# Altium project 1010810PA_HVFlyback_GDTestboard.PrjPcb (part 2 of 2)

## Sheet 1010829PA_HVFlyback_GD_Testboard_GateDrive.SchDoc: Schematitel
size A3; CompanyName: drivetek ag; DrawnBy: NLE; Address1: industriestrasse 37; Address2: 2555 brügg; Address3: Switzerland; SheetNumber: 10; SheetTotal: 10; ProjectTitle: HVFlyback_GDTestboard; PageSetup: Record=PageOptions|CenterHorizontal=True|CenterVertical=True|PrintScale=1.00|XCorrection=1.00|YCorrection=1.00|PrintKind=1|BorderSize=5000000|LeftOffset=0|BottomOffset=0|Orientation=2|PaperLength=1000|PaperWidth=1000|Scale=100|PaperSource=7|PrintQuality=-4|MediaType=1|DitherType=10|PaperKind=A3|PrintScaleMode=1
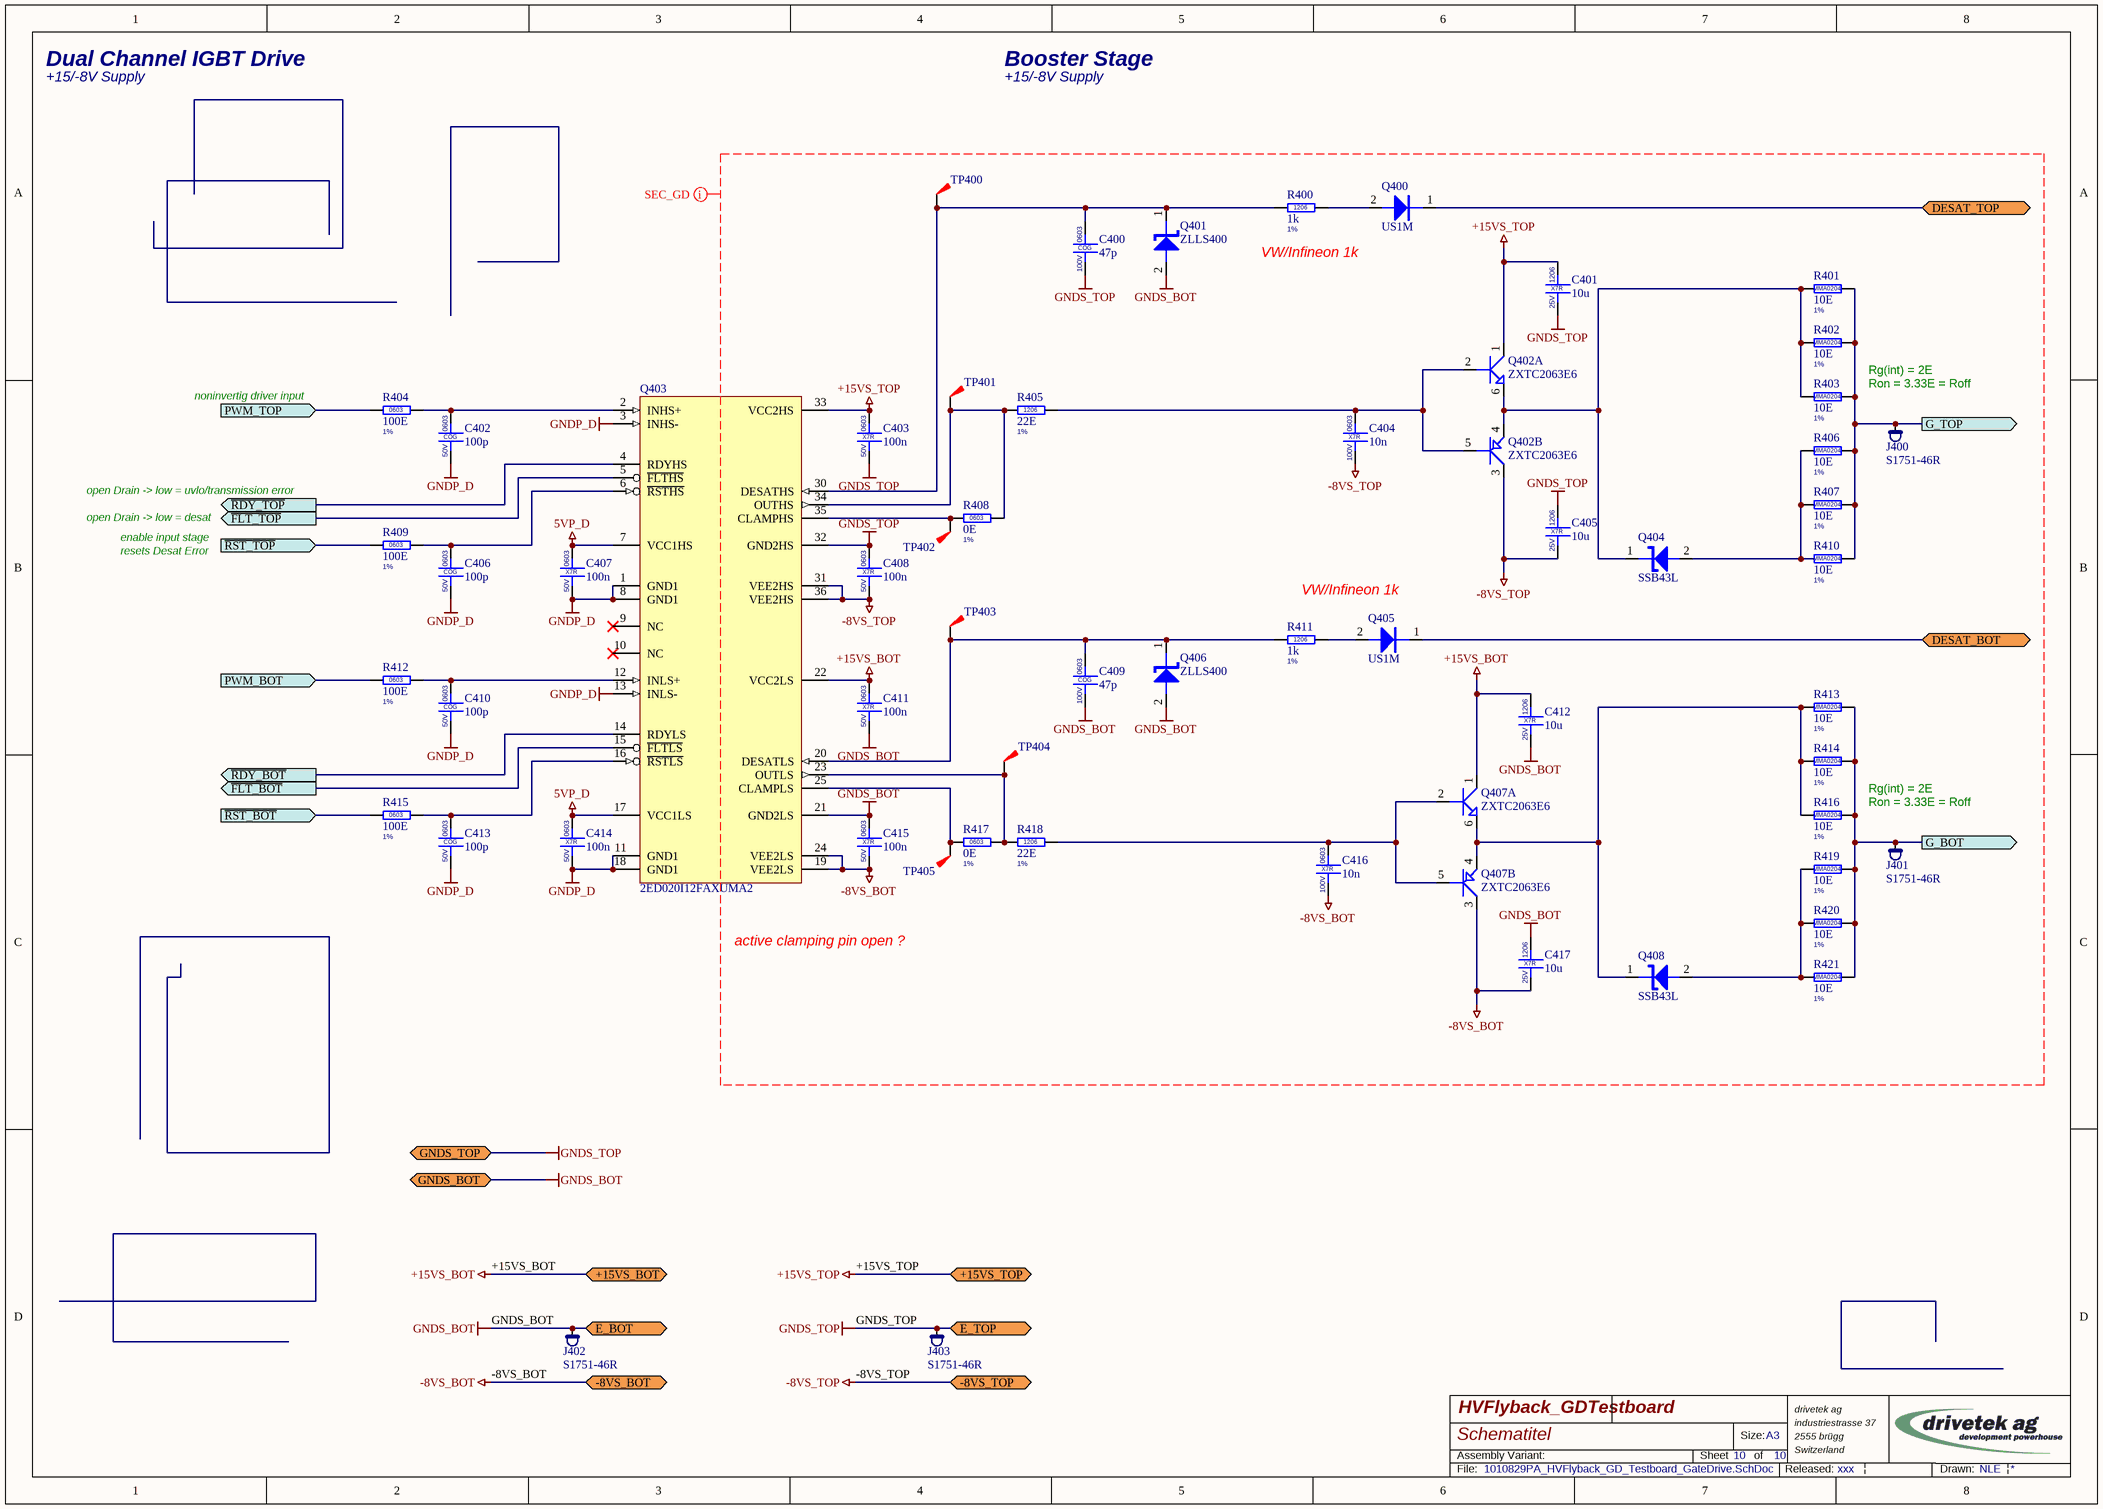
[diagram p3: 1010829PA_HVFlyback_GD_Testboard_GateDrive.SchDoc]

### Parts
C400  47p  CaseName: 0603  Type3: COG  Voltage: 100V  [02_0603_DRK_1-7x1-0x0-9]
C401  10u  Type3: X7R  Voltage: 25V  CaseName: 1206  [02_1206_DRK_3-4x1-8x1-8]
C402  100p  CaseName: 0603  Type3: COG  Voltage: 50V  [02_0603_DRK_1-7x1-0x0-9]
C403  100n  CaseName: 0603  Type3: X7R  Voltage: 50V  [02_0603_DRK_1-7x1-0x0-9]
C404  10n  CaseName: 0603  Type3: X7R  Voltage: 100V  [02_0603_DRK_1-7x1-0x0-9]
C405  10u  Type3: X7R  Voltage: 25V  CaseName: 1206  [02_1206_DRK_3-4x1-8x1-8]
C406  100p  CaseName: 0603  Type3: COG  Voltage: 50V  [02_0603_DRK_1-7x1-0x0-9]
C407  100n  CaseName: 0603  Type3: X7R  Voltage: 50V  [02_0603_DRK_1-7x1-0x0-9]
C408  100n  CaseName: 0603  Type3: X7R  Voltage: 50V  [02_0603_DRK_1-7x1-0x0-9]
C409  47p  CaseName: 0603  Type3: COG  Voltage: 100V  [02_0603_DRK_1-7x1-0x0-9]
C410  100p  CaseName: 0603  Type3: COG  Voltage: 50V  [02_0603_DRK_1-7x1-0x0-9]
C411  100n  CaseName: 0603  Type3: X7R  Voltage: 50V  [02_0603_DRK_1-7x1-0x0-9]
C412  10u  Type3: X7R  Voltage: 25V  CaseName: 1206  [02_1206_DRK_3-4x1-8x1-8]
C413  100p  CaseName: 0603  Type3: COG  Voltage: 50V  [02_0603_DRK_1-7x1-0x0-9]
C414  100n  CaseName: 0603  Type3: X7R  Voltage: 50V  [02_0603_DRK_1-7x1-0x0-9]
C415  100n  CaseName: 0603  Type3: X7R  Voltage: 50V  [02_0603_DRK_1-7x1-0x0-9]
C416  10n  CaseName: 0603  Type3: X7R  Voltage: 100V  [02_0603_DRK_1-7x1-0x0-9]
C417  10u  Type3: X7R  Voltage: 25V  CaseName: 1206  [02_1206_DRK_3-4x1-8x1-8]
J400  S1751-46R  [13_PAD_DRK_HARWIN_S1751-46]
J401  S1751-46R  [13_PAD_DRK_HARWIN_S1751-46]
J402  S1751-46R  [13_PAD_DRK_HARWIN_S1751-46]
J403  S1751-46R  [13_PAD_DRK_HARWIN_S1751-46]
Q400  US1M  [03_SMA_DRK]
Q401  ZLLS400  [03_SOD323_DRK]
Q402  ZXTC2063E6  [03_SOT23-6_DRK]  (parts A,B of 2)
Q403  2ED020I12FAXUMA2  [04_DSO-36_DRK]
Q404  SSB43L  [03_SMB_DRK]
Q405  US1M  [03_SMA_DRK]
Q406  ZLLS400  [03_SOD323_DRK]
Q407  ZXTC2063E6  [03_SOT23-6_DRK]  (parts A,B of 2)
Q408  SSB43L  [03_SMB_DRK]
R400  1k  Tolerance: 1%  CaseName: 1206  [01_1206_DRK_3-4x1-8x0-65]
R401  10E  Tolerance: 1%  CaseName: MMA0204  [01_MMA0204_DRK]
R402  10E  Tolerance: 1%  CaseName: MMA0204  [01_MMA0204_DRK]
R403  10E  Tolerance: 1%  CaseName: MMA0204  [01_MMA0204_DRK]
R404  100E  Tolerance: 1%  CaseName: 0603  [01_0603_DRK_1-7x1-0x0-55]
R405  22E  Tolerance: 1%  CaseName: 1206  [01_1206_DRK_3-4x1-8x0-65]
R406  10E  Tolerance: 1%  CaseName: MMA0204  [01_MMA0204_DRK]
R407  10E  Tolerance: 1%  CaseName: MMA0204  [01_MMA0204_DRK]
R408  0E  Tolerance: 1%  CaseName: 0603  [01_0603_DRK_1-7x1-0x0-55]
R409  100E  Tolerance: 1%  CaseName: 0603  [01_0603_DRK_1-7x1-0x0-55]
R410  10E  Tolerance: 1%  CaseName: MMA0204  [01_MMA0204_DRK]
R411  1k  Tolerance: 1%  CaseName: 1206  [01_1206_DRK_3-4x1-8x0-65]
R412  100E  Tolerance: 1%  CaseName: 0603  [01_0603_DRK_1-7x1-0x0-55]
R413  10E  Tolerance: 1%  CaseName: MMA0204  [01_MMA0204_DRK]
R414  10E  Tolerance: 1%  CaseName: MMA0204  [01_MMA0204_DRK]
R415  100E  Tolerance: 1%  CaseName: 0603  [01_0603_DRK_1-7x1-0x0-55]
R416  10E  Tolerance: 1%  CaseName: MMA0204  [01_MMA0204_DRK]
R417  0E  Tolerance: 1%  CaseName: 0603  [01_0603_DRK_1-7x1-0x0-55]
R418  22E  Tolerance: 1%  CaseName: 1206  [01_1206_DRK_3-4x1-8x0-65]
R419  10E  Tolerance: 1%  CaseName: MMA0204  [01_MMA0204_DRK]
R420  10E  Tolerance: 1%  CaseName: MMA0204  [01_MMA0204_DRK]
R421  10E  Tolerance: 1%  CaseName: MMA0204  [01_MMA0204_DRK]
TP400  TP THT Dia 0.8mm, Hole 0.3mm  [13_TP_0-3_0-8mm]  (value not drawn)  (no BOM)
TP401  TP THT Dia 0.8mm, Hole 0.3mm  [13_TP_0-3_0-8mm]  (value not drawn)  (no BOM)
TP402  TP THT Dia 0.8mm, Hole 0.3mm  [13_TP_0-3_0-8mm]  (value not drawn)  (no BOM)
TP403  TP THT Dia 0.8mm, Hole 0.3mm  [13_TP_0-3_0-8mm]  (value not drawn)  (no BOM)
TP404  TP THT Dia 0.8mm, Hole 0.3mm  [13_TP_0-3_0-8mm]  (value not drawn)  (no BOM)
TP405  TP THT Dia 0.8mm, Hole 0.3mm  [13_TP_0-3_0-8mm]  (value not drawn)  (no BOM)

### Ports
+15VS_BOT (bidir), +15VS_TOP (bidir), -8VS_BOT (bidir), -8VS_TOP (bidir), DESAT_BOT (bidir), DESAT_TOP (bidir), E_BOT (bidir), E_TOP (bidir), G_BOT (out), G_TOP (out), GNDS_BOT (bidir), GNDS_TOP (bidir), PWM_BOT (in), PWM_TOP (in), ~{FLT_BOT} (out), ~{FLT_TOP} (out), ~{RDY_BOT} (out), ~{RDY_TOP} (out), ~{RST_BOT} (in), ~{RST_TOP} (in)

### Nets
5VP_D: C407.1 C414.1 Q403.7(VCC1HS) Q403.17(VCC1LS)
+15VS_BOT: C401.1 C403.1 C411.1 C412.1 Q402.1 Q403.22(VCC2LS) Q403.33(VCC2HS) Q407.1 ; port +15VS_BOT, port +15VS_TOP  [also labelled +15VS_TOP]
-8VS_BOT: C404.2 C405.2 C408.2 C415.2 C416.2 C417.2 Q402.3 Q403.19(VEE2LS) Q403.24(VEE2LS) Q403.31(VEE2HS) Q403.36(VEE2HS) Q407.3 ; port -8VS_BOT, port -8VS_TOP  [also labelled -8VS_TOP]
DC+: Q400.1 ; port DESAT_TOP
GNDP_D: C402.2 C406.2 C407.2 C410.2 C413.2 C414.2 Q403.1(GND1) Q403.3(INHS-) Q403.8(GND1) Q403.11(GND1) Q403.13(INLS-) Q403.18(GND1)
GNDS_BOT: C400.2 C401.2 C403.2 C405.1 C408.1 C409.2 C411.2 C412.2 C415.1 C417.1 J402.1 J403.1 Q401.2 Q403.21(GND2LS) Q403.32(GND2HS) Q406.2 ; port E_BOT, port E_TOP, port GNDS_TOP, port GNDS_BOT  [also labelled GNDS_TOP]
NetC100_1: R409.1 ; port ~{RST_TOP}
NetC101_1: R415.1 ; port ~{RST_BOT}
NetC400_1: C400.1 Q401.1 Q403.30(DESATHS) R400.1 TP400.1
NetC402_1: C402.1 Q403.2(INHS+) R404.2
NetC404_1: C404.1 Q402.2 Q402.5 R405.1
NetC406_1: C406.1 Q403.6(~{RSTHS}) R409.2
NetC409_1: C409.1 Q403.20(DESATLS) Q406.1 R411.1 TP403.1
NetC410_1: C410.1 Q403.12(INLS+) R412.2
NetC413_1: C413.1 Q403.16(~{RSTLS}) R415.2
NetC416_1: C416.1 Q407.2 Q407.5 R418.1
NetJ110_1: R404.1 ; port PWM_TOP
NetJ112_1: Q403.4(RDYHS) ; port ~{RDY_TOP}
NetJ114_1: R412.1 ; port PWM_BOT
NetJ116_1: Q403.5(~{FLTHS}) ; port ~{FLT_TOP}
NetJ121_1: Q403.14(RDYLS) ; port ~{RDY_BOT}
NetJ124_1: Q403.15(~{FLTLS}) ; port ~{FLT_BOT}
NetJ400_1: J400.1 R401.1 R402.1 R403.1 R406.1 R407.1 R410.1 ; port G_TOP
NetJ401_1: J401.1 R413.1 R414.1 R416.1 R419.1 R420.1 R421.1 ; port G_BOT
NetQ400_2: Q400.2 R400.2
NetQ402_4: Q402.4 Q402.6 Q404.1 R401.2 R402.2 R403.2
NetQ403_23: Q403.23(OUTLS) R417.1 R418.2 TP404.1
NetQ403_25: Q403.25(CLAMPLS) R417.2 TP405.1
NetQ403_34: Q403.34(OUTHS) R405.2 R408.2 TP401.1
NetQ403_35: Q403.35(CLAMPHS) R408.1 TP402.1
NetQ404_2: Q404.2 R406.2 R407.2 R410.2
NetQ405_1: Q405.1 ; port DESAT_BOT
NetQ405_2: Q405.2 R411.2
NetQ407_4: Q407.4 Q407.6 Q408.1 R413.2 R414.2 R416.2
NetQ408_2: Q408.2 R419.2 R420.2 R421.2

Not connected (* = marked no-connect by the designer): Q403 9(NC)* 10(NC)*

### Layout directives
net class SEC_GD: +15VS_BOT, +15VS_TOP, -8VS_BOT, -8VS_TOP, GNDS_BOT, GNDS_TOP

### Notes on the sheet
- Dual Channel IGBT Drive
- +15/-8V Supply
- Booster Stage
- VW/Infineon 1k
- Ron = 3.33E = Roff
- Rg(int) = 2E
- noninvertig driver input
- open Drain -> low = uvlo/transmission error
- open Drain -> low = desat
- resets Desat Error
- enable input stage
- active clamping pin open ?
- Assembly Variant:
- Sheet
- Size:
- of
- A3
- File:
- Released:
- |
- Drawn:

### Library data of the parts
C400 C409 = 02-0270: Part Description: Ceramic 0603 47pF 100V COG Flexiterm; Manufacturer 1: Kemet; Manufacturer Part Number 1: C0603X470J1GACTU; LatestRevision Note: Initial; Type1: CAP; Type2: Ceramic; Tolerance: 5; Order Number: 80-C0603X470J1G; Part Number: 02-0270; Author: RLE; PartValue: 47p; ROHS: True; ComponentLink1Description: Datasheet; ComponentLink1URL: http://www.kemet.com/kemet/web/homepage/kechome.nsf/file/Flexible%20Termination%20Ceramic%20Chip%20Capacitors%20%28FT-CAP%29/$file/KEM_C1013_X7R_FT-CAP_SMD.pdf; LatestRevision Date: 22.06.2012; Distributor: Mouser; Price: 0.36
C401 C405 C412 C417 = 02-0262: Part Description: Ceramic 1206 10uF 25V X7R flexiterm, automotive; Manufacturer 1: TDK; Manufacturer Part Number 1: CGA5L1X7R1E106M160AE; Type1: CAP; Type2: Ceramic; Tolerance: 20; Order Number: 445-7969-1-ND; LatestRevision Note: Initial; Order Number 2: 810-CGA5L1X7R1E106KS; Part Number: 02-0262; Author: CBA; PartValue: 10u; ROHS: True; ComponentLink1Description: Datasheet; ComponentLink1URL: http://tdk.com/pdf/automotive_B11.pdf; Distributor: Digikey; Price: 1.24; LatestRevision Date: 15.06.2012; Distributor 2: Mouser; Manufacturer 2: TDK; Manufacturer Part Number 2: CGA5L1X7R1E106K160AE
C402 C406 C410 C413 = 02-0380: Part Description: Ceramic 0603 100pF 50V 5% C0G  AEC-Q200; Manufacturer 1: Murata; Manufacturer Part Number 1: GCM1885C1H101JA16D; LatestRevision Note: Initial; Type1: CAP; Type2: Ceramic; Tolerance: 5; Order Number: 81-GCM1885C1H101JA6D; Part Number: 02-0380; Author: RLE; PartValue: 100p; ROHS: True; ComponentLink1Description: Datasheet; ComponentLink1URL: http://www.murata.com/products/catalog/pdf/c03e.pdf; LatestRevision Date: 12.09.2016; Distributor: Mouser; Price: 0.1
C403 C407 C408 C411 C414 C415 = 02-0342: Part Description: Ceramic 0603 100nF 50V X7R, AEC-Q200, Fail-Save, Deflecting Crack; Manufacturer 1: Murata; Manufacturer Part Number 1: GCJ188R71H104KA12D; LatestRevision Note: Initial; Type1: CAP; Type2: Ceramic; Tolerance: 10; Order Number: 81-GCJ188R71H104KA2D; Part Number: 02-0342; Author: RLE; PartValue: 100n; ROHS: True; ComponentLink1Description: Datasheet; ComponentLink1URL: http://www.murata.com/~/media/webrenewal/support/library/catalog/products/capacitor/mlcc/c03e.ashx; LatestRevision Date: 15.07.2015; Distributor: Mouser; Price: 0.257
C404 C416 = 02-0313: Part Description: Ceramic 0603 10n 100V 10% X7R, AEC-Q200; Manufacturer 1: Murata; Manufacturer Part Number 1: GCM188R72A103KA37D; LatestRevision Note: Initial; Type1: CAP; Type2: Ceramic; Tolerance: 10; Order Number: 81-GCM188R72A103KA7D; Part Number: 02-0313; Author: RLE; PartValue: 10n; ROHS: True; ComponentLink1Description: Datasheet; ComponentLink1URL: http://psearch.murata.com/capacitor/product/GCM1885C1H100JA16%23.pdf; LatestRevision Date: 25.06.2014; Distributor: Mouser; Price: 0.1
J400-J403 = 13-0487: Probe Hook; Part Description: SMD Probe Hook 2mm HIGH, 3.45x1.85mm; Manufacturer 1: Harwin; LatestRevision Note: Initial; Type1: TP; Type2: SMD; Order Number: 952-1478-2-ND; Order Number 2: 855-S1751-46R; Part Number: 13-0487; Author: CSI; PartValue: S1751-46R; ROHS: True; ComponentLink1Description: Datasheet; ComponentLink1URL: https://cdn.harwin.com/pdfs/60page187.pdf; LatestRevision Date: 19.09.2016; Manufacturer Part Number 1: S1751-46R; Distributor: DigiKey; Price: 0.25; Distributor 2: Mouser
Q400 Q405 = 03-0182: Part Description: Ultra Fast Recovery Rectifier, 1000V / 1A / 75ns; Manufacturer 1: Vishay; Manufacturer Part Number 1: US1MHE3_A/H; LatestRevision Note: Initial; Type1: DIODE; Type2: Power; Voltage: 1000V; Current: 1A; Order Number: 78-US1MHE3_A/H; Order Number 2: 78-US1MHE3_A/I; Part Number: 03-0182; Author: RLE; PartValue: US1M; CaseName: SMA; ROHS: True; ComponentLink1Description: Datasheet; ComponentLink1URL: http://www.vishay.com/docs/88768/88768.pdf; LatestRevision Date: 29.12.2011; Distributor: Mouser; Price: 0.225; Distributor 2: Mouser
Q401 Q406 = 03-0389: Part Description: Low VF, fast switching Schottky, extremely low leakage; Manufacturer 1: Diodes; Manufacturer Part Number 1: ZLLS400TA; LatestRevision Note: Checked; Type1: DIODE; Type2: Signal; Voltage: 40V; Current: 520m; Order Number: 522-ZLLS400TA; Checked: CRA; Part Number: 03-0389; Author: RLE; PartValue: ZLLS400; CaseName: SOD323; ROHS: True; ComponentLink1Description: Datasheet; ComponentLink1URL: http://www.diodes.com/_files/datasheets/ZLLS400.pdf; LatestRevision Date: 24.03.2016; Distributor: Mouser; Price: 0.413
Q402 Q407 = 03-0248: Part Description: 40V /3.5A  Complementary (NPN/PNP) Medium Power Transistor, AEC-Q 101; Manufacturer 1: Diodes Inc; LatestRevision Note: Initial; Type2: Power; Voltage: 40V; Current: 3A5; Order Number: 522-ZXTC2063E6TA; Order Number 2: ZXTC2063E6CT-ND; Part Number: 03-0248; Author: RLE; PartValue: ZXTC2063E6; CaseName: SOT23-6; ROHS: True; ComponentLink1Description: Datasheet; ComponentLink1URL: http://www.diodes.com/datasheets/ZXTC2063E6.pdf; LatestRevision Date: 13.12.2013; Manufacturer Part Number 1: ZXTC2063E6; Distributor: Mouser; Price: 0.745; Distributor 2: DigiKey
Q403 = 04-0486: Dual IGBT Driver IC; Manufacturer: Infineon Technologies; Part Description: Galvanic isolated dual channel IGBT driver - 2A; Manufacturer 1: Infineon; LatestRevision Note: Initial; Type1: MIXSIG; Order Number: 2762284; Order Number 2: 726-2ED020I12FAXUMA2; ManufacturerPartNumber: 2ED020I12FA; PackageReference: PG-DSO-36; Part Number: 04-0486; Author: RVI; PartValue: 2ED020I12FAXUMA2; CaseName: DSO-36; ROHS: True; ComponentLink1Description: Datasheet; ComponentLink1URL: https://www.infineon.com/dgdl/Infineon-2ED020I12FA-DS-v03_01-EN.pdf?fileId=db3a30432e779412012e7b87d2b23878; LatestRevision Date: 21.07.2017; Manufacturer Part Number 1: 2ED020I12FAXUMA2; Distributor: Farnell; Price: 9.96; Distributor 2: Mouser
Q404 Q408 = 03-0112: Part Description: High current density schottky rectifier; Manufacturer 1: Vishay; LatestRevision Note: Checked; Type1: DIODE; Type2: Power; Voltage: 30V; Current: 4A; Order Number: SSB43L-E3/52TGICT-ND; Checked: HHU; Part Number: 03-0112; Author: MSC; PartValue: SSB43L; CaseName: SMB; ROHS: True; ComponentLink1Description: Datasheet; ComponentLink1URL: http://www.vishay.com/docs/88884/ssb43l.pdf; LatestRevision Date: 27.11.2008; Manufacturer Part Number 1: SSB43L; Distributor: Digikey; Price: 0.45
R400 R411 = 01-0257: Part Description: 1206 1k 200V 0.125W 1%; Manufacturer 1: Multicomp; Manufacturer Part Number 1: MC 0.125W1206 1% 1K; LatestRevision Note: Checked; Type1: RES; Type2: Thickfilm; Voltage: 200V; Power: 125m; Checked: CBA; Order Number: 9335757; Part Number: 01-0257; Author: CBA; PartValue: 1k; ROHS: True; ComponentLink1Description: Datasheet; ComponentLink1URL: http://www.farnell.com/datasheets/90824.pdf; LatestRevision Date: 06.10.2006; Distributor: Farnell; Price: 0.055
R401 R402 R406 R407 R410 R413 R414 R419-R421 = 01-0574: Part Description: Mini-Melf 10R 200V 0.25W; Manufacturer 1: Vishay; Manufacturer Part Number 1: MMA02040C1009F; LatestRevision Note: Initial; Type1: RES; Type2: Metalfilm; Voltage: 200V; Power: 250m; Order Number: 594-MMA02040C1009FB3; Order Number 2: 3087542; Part Number: 01-0574; Author: MFR; PartValue: 10E; ROHS: True; ComponentLink1Description: Datasheet; ComponentLink1URL: http://www.vishay.com/docs/28713/melfprof.pdf; LatestRevision Date: 15.06.2012; Distributor: Mouser; Price: 0.1; Distributor 2: Farnell
R403 R416 = 01-0574: Part Description: Mini-Melf 10R 200V 0.25W; Manufacturer 1: Vishay; Manufacturer Part Number 1: MMA02040C1009F; LatestRevision Note: Initial; Type1: RES; Type2: Metalfilm; Power: 250m; Order Number: 594-MMA02040C1009FB3; Voltage: 200V; Order Number 2: 3087542; Part Number: 01-0574; Author: MFR; PartValue: 10E; ROHS: True; ComponentLink1Description: Datasheet; ComponentLink1URL: http://www.vishay.com/docs/28713/melfprof.pdf; LatestRevision Date: 15.06.2012; Distributor: Mouser; Price: 0.1; Distributor 2: Farnell
R404 R409 R412 R415 = 01-0770: Part Description: 0603 100E 75VV 0.1W 1% 100ppm, AEC-Q200; Manufacturer 1: Panasonic; Manufacturer Part Number 1: ERJ3EKF1000V; LatestRevision Note: Inital; Type1: RES; Type2: Thickfilm; Voltage: 75V; Power: 100m; Order Number: 2303059; Part Number: 01-0770; Author: RVI; PartValue: 100E; ROHS: True; ComponentLink1Description: Datasheet; ComponentLink1URL: http://www.farnell.com/datasheets/2111203.pdf?_ga=2.233800540.312604292.1501488576-657638312.1494329784; LatestRevision Date: 31.07.2017; Distributor: Farnell; Price: 0.05
R405 R418 = 01-0675: Part Description: 1206 22E 200V 500mW 1% AEC-Q200; Manufacturer 1: Vishay; Manufacturer Part Number 1: CRCW120622R0FKEAHP; LatestRevision Note: Initial; Type1: RES; Type2: Thickfilm; Voltage: 200V; Power: 500m; Order Number: 71-CRCW120622R0FKEAH; Order Number 2: 541-22.0UTR-ND; Part Number: 01-0675; Author: CSI; PartValue: 22E; ROHS: True; ComponentLink1Description: Datasheet; ComponentLink1URL: http://www.vishay.com/docs/20043/crcwhpe3.pdf; LatestRevision Date: 27.01.2015; Distributor: Mouser; Price: 0.098; Distributor 2: Digikey
R408 R417 = 01-0128: Part Description: 0603 0E 50V 0.063W 1%; Manufacturer 1: Multicomp; Manufacturer Part Number 1: MC 0.063W 0603 0R; LatestRevision Note: Checked; Type1: RES; Type2: Thickfilm; Voltage: 50V; Power: 63m; Checked: CBA; Order Number: 9331662; Part Number: 01-0128; Author: CBA; PartValue: 0E; ROHS: True; ComponentLink1Description: Datasheet; ComponentLink1URL: http://www.farnell.com/datasheets/90824.pdf; LatestRevision Date: 06.10.2006; Distributor: Farnell; Price: 0.06
TP400-TP405 = 13-0524: Part Description: Test point THT - Dia 0.8mm, Hole 0.3mm; LatestRevision Note: Initial; Type2: TH; Part Number: 13-0524; Author: RVI; Type1: TP; PartValue: TP THT Dia 0.8mm, Hole 0.3mm; CaseName: 0.8mm; ROHS: True; ComponentLink1Description: Datasheet; LatestRevision Date: 10.07.2017; Price: 0

## Sheet 1010829PA_HVFlyback_GD_Testboard_PowerStage.SchDoc: Flyback
size A4; CompanyName: drivetek ag; DrawnBy: NLE; Address1: industriestrasse 37; Address2: 2555 brügg; Address3: Switzerland; SheetNumber: 2; SheetTotal: 2; ProjectTitle: HVFlyback_GDTestboard
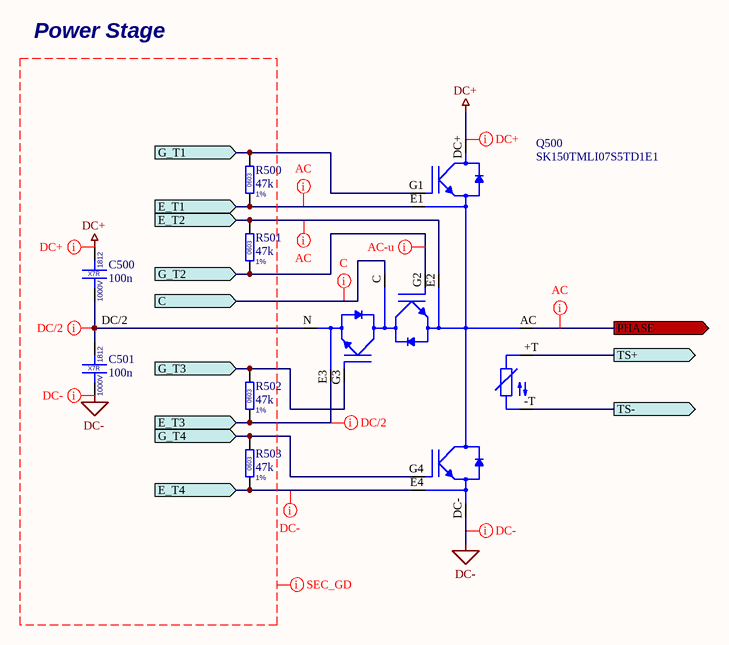
[diagram p4: 1010829PA_HVFlyback_GD_Testboard_PowerStage.SchDoc]

### Parts
C500  100n  Voltage: 1000V  CaseName: 1812  Type3: X7R  [02_1812_DRK_1-65mm]
C501  100n  Voltage: 1000V  CaseName: 1812  Type3: X7R  [02_1812_DRK_1-65mm]
Q500  SK150TMLI07S5TD1E1  [03_SK150TMLI07S5TD1E1]  (no BOM)
R500  47k  Tolerance: 1%  CaseName: 0603  [01_0603_DRK_1-7x1-0x0-55]
R501  47k  Tolerance: 1%  CaseName: 0603  [01_0603_DRK_1-7x1-0x0-55]
R502  47k  Tolerance: 1%  CaseName: 0603  [01_0603_DRK_1-7x1-0x0-55]
R503  47k  Tolerance: 1%  CaseName: 0603  [01_0603_DRK_1-7x1-0x0-55]

### Ports
C (in), E_T1 (in), E_T2 (in), E_T3 (in), E_T4 (in), G_T1 (in), G_T2 (in), G_T3 (in), G_T4 (in), PHASE (out), TS+ (out), TS- (out)

### Nets
DC+: C500.1 Q500.DC+
DC-: C501.2 Q500.DC-
GNDS_BOT: Q500.E1 Q500.E2 R500.2 R501.1 ; port E_T1, port E_T2
DC/2: C500.2 C501.1 Q500.N
NetJ113_1: Q500.AC ; port PHASE
NetJ117_1: Q500.+T ; port TS+
NetJ120_1: Q500.-T ; port TS-
NetJ400_1: Q500.G1 R500.1 ; port G_T1
NetJ401_1: Q500.G2 R501.2 ; port G_T2
NetQ405_1: Q500.C ; port C
NetQ500_E3: Q500.E3 R502.2 ; port E_T3
NetQ500_E4: Q500.E4 R503.2 ; port E_T4
NetQ500_G3: Q500.G3 R502.1 ; port G_T3
NetQ500_G4: Q500.G4 R503.1 ; port G_T4

### Layout directives
net class DC+: DC+
net class DC/2: DC/2, NetQ500_E3
net class DC-: DC-, NetQ500_E4
net class AC: GNDS_BOT, NetJ113_1
net class C: NetQ405_1
net class SEC_GD: DC+, DC-, DC/2
net class AC-u: NetJ401_1

### Notes on the sheet
- Power Stage
- Assembly Variant:
- Sheet
- Size:
- of
- A4
- File:
- Released:
- |
- Drawn:

### Library data of the parts
C500 C501 = 02-0279: Part Description: Ceramic 1812 100n 1000VDC X7R flexiterm; Manufacturer 1: Kemet; Manufacturer Part Number 1: C1812X104KDRACTU; LatestRevision Note: Initial; Type1: CAP; Type2: Ceramic; Tolerance: 10; Order Number: 80-C1812X104KDRACTU; Part Number: 02-0279; Author: RLE; PartValue: 100n; ROHS: True; ComponentLink1Description: Datasheet; ComponentLink1URL: http://www.kemet.com/kemet/web/homepage/kechome.nsf/file/KEM_C1034_X7R_HV_ARC_SMD/$file/KEM_C1034_X7R_HV_ARC_SMD.pdf; LatestRevision Date: 04.07.2012; Distributor: Mouser; Price: 0.92
Q500 = 03-0421: Part Description: Single phase TNPC, 650V, 150A, mit NTC, Preliminary; Manufacturer 1: Semikron; LatestRevision Note: Initial; Type1: MODULE; Type2: Power; Voltage: 650V; Current: 150A; Part Number: 03-0421; Author: NLE; PartValue: SK150TMLI07S5TD1E1; CaseName: SEMITOP E1; ROHS: False; ComponentLink1Description: Datasheet; LatestRevision Date: 13.11.2017; Manufacturer Part Number 1: SK150TMLI07S5TD1E1; Distributor: Semikron; Price: 0; ComponentLink1URL: K:\Volkswagen\1779_LE_BZ_Luftversorgung\03_Hardware\Datenblätter VW ELV\Modul\OFF-17-0180.01_VW_SEMITOPE1_technical information 24.08.17.pdf; Order Number: SK150TMLI07S5TD1E1
R500-R503 = 01-0088: Part Description: 0603 47k 50V 0.063W 1%; Manufacturer 1: Multicomp; Manufacturer Part Number 1: MC 0.063W 0603 1% 47K; LatestRevision Note: Checked; Type1: RES; Type2: Thickfilm; Voltage: 50V; Power: 63m; Checked: CBA; Order Number: 9331255; Part Number: 01-0088; Author: CBA; PartValue: 47k; ROHS: True; ComponentLink1Description: Datasheet; ComponentLink1URL: http://www.farnell.com/datasheets/90824.pdf; LatestRevision Date: 06.10.2006; Distributor: Farnell; Price: 0.06

## Nets that join several sheets
5VP_D: 1010829PA_HVFlyback_GD_Testboard_Overview (J104.1 R101.2 R102.2), 1010829PA_HVFlyback_GD_Testboard_GateDrive (C407.1 C414.1 Q403.7 Q403.17)
15VP_D: 1010829PA_HVFlyback_GD_Testboard_Overview (J105.1 J106.1), 1010829PA_HVFlyback_GD_Testboard_GDSupply (14 pins)
+15VS_BOT: 1010829PA_HVFlyback_GD_Testboard_Overview (J126.1), 1010829PA_HVFlyback_GD_Testboard_GDSupply (C304.2 J300.1 Q301.1), 1010829PA_HVFlyback_GD_Testboard_GateDrive (8 pins)
-8VS_BOT: 1010829PA_HVFlyback_GD_Testboard_Overview (J128.1), 1010829PA_HVFlyback_GD_Testboard_GDSupply (C306.1 J302.1 Q305.2), 1010829PA_HVFlyback_GD_Testboard_GateDrive (12 pins)
DC+: 1010829PA_HVFlyback_GD_Testboard_Overview (J109.1), 1010829PA_HVFlyback_GD_Testboard_GateDrive (Q400.1), 1010829PA_HVFlyback_GD_Testboard_PowerStage (C500.1 Q500.DC+)
DC-: 1010829PA_HVFlyback_GD_Testboard_Overview (J125.1), 1010829PA_HVFlyback_GD_Testboard_PowerStage (C501.2 Q500.DC-)
GNDP_D: 1010829PA_HVFlyback_GD_Testboard_Overview (8 pins), 1010829PA_HVFlyback_GD_Testboard_GDSupply (14 pins), 1010829PA_HVFlyback_GD_Testboard_GateDrive (12 pins)
GNDP_P_HV: 1010829PA_HVFlyback_GD_Testboard_Overview (J103.1), 1010829PA_HVFlyback_GD_Testboard_Flyback (7 pins)
GNDS_BOT: 1010829PA_HVFlyback_GD_Testboard_Overview (J127.1), 1010829PA_HVFlyback_GD_Testboard_GDSupply (5 pins), 1010829PA_HVFlyback_GD_Testboard_GateDrive (16 pins), 1010829PA_HVFlyback_GD_Testboard_PowerStage (Q500.E1 Q500.E2 R500.2 R501.1)
GNDS_P_HV: 1010829PA_HVFlyback_GD_Testboard_Overview (J102.1 R100.1), 1010829PA_HVFlyback_GD_Testboard_Flyback (6 pins)
NetC100_1: 1010829PA_HVFlyback_GD_Testboard_Overview (5 pins), 1010829PA_HVFlyback_GD_Testboard_GateDrive (R409.1)
NetC101_1: 1010829PA_HVFlyback_GD_Testboard_Overview (5 pins), 1010829PA_HVFlyback_GD_Testboard_GateDrive (R415.1)
NetC201_1: 1010829PA_HVFlyback_GD_Testboard_Overview (J101.1 R100.2), 1010829PA_HVFlyback_GD_Testboard_Flyback (6 pins)
NetC205_1: 1010829PA_HVFlyback_GD_Testboard_Overview (J100.1), 1010829PA_HVFlyback_GD_Testboard_Flyback (9 pins)
NetJ110_1: 1010829PA_HVFlyback_GD_Testboard_Overview (J110.1 J111.1), 1010829PA_HVFlyback_GD_Testboard_GateDrive (R404.1)
NetJ112_1: 1010829PA_HVFlyback_GD_Testboard_Overview (J112.1), 1010829PA_HVFlyback_GD_Testboard_GateDrive (Q403.4)
NetJ113_1: 1010829PA_HVFlyback_GD_Testboard_Overview (J113.1), 1010829PA_HVFlyback_GD_Testboard_PowerStage (Q500.AC)
NetJ114_1: 1010829PA_HVFlyback_GD_Testboard_Overview (J114.1 J115.1), 1010829PA_HVFlyback_GD_Testboard_GateDrive (R412.1)
NetJ116_1: 1010829PA_HVFlyback_GD_Testboard_Overview (J116.1), 1010829PA_HVFlyback_GD_Testboard_GateDrive (Q403.5)
NetJ117_1: 1010829PA_HVFlyback_GD_Testboard_Overview (J117.1), 1010829PA_HVFlyback_GD_Testboard_PowerStage (Q500.+T)
NetJ120_1: 1010829PA_HVFlyback_GD_Testboard_Overview (J120.1), 1010829PA_HVFlyback_GD_Testboard_PowerStage (Q500.-T)
NetJ121_1: 1010829PA_HVFlyback_GD_Testboard_Overview (J121.1), 1010829PA_HVFlyback_GD_Testboard_GateDrive (Q403.14)
NetJ124_1: 1010829PA_HVFlyback_GD_Testboard_Overview (J124.1), 1010829PA_HVFlyback_GD_Testboard_GateDrive (Q403.15)
NetJ400_1: 1010829PA_HVFlyback_GD_Testboard_GateDrive (7 pins), 1010829PA_HVFlyback_GD_Testboard_PowerStage (Q500.G1 R500.1)
NetJ401_1: 1010829PA_HVFlyback_GD_Testboard_GateDrive (7 pins), 1010829PA_HVFlyback_GD_Testboard_PowerStage (Q500.G2 R501.2)
NetQ405_1: 1010829PA_HVFlyback_GD_Testboard_GateDrive (Q405.1), 1010829PA_HVFlyback_GD_Testboard_PowerStage (Q500.C)

## Assembly variants
Basic: not fitted R208